# Altium schematic sheet [06] - POWER.SchDoc (part 1 of 2)
size A3; DocumentNumber: 7; SheetNumber: 7; SheetTotal: 12
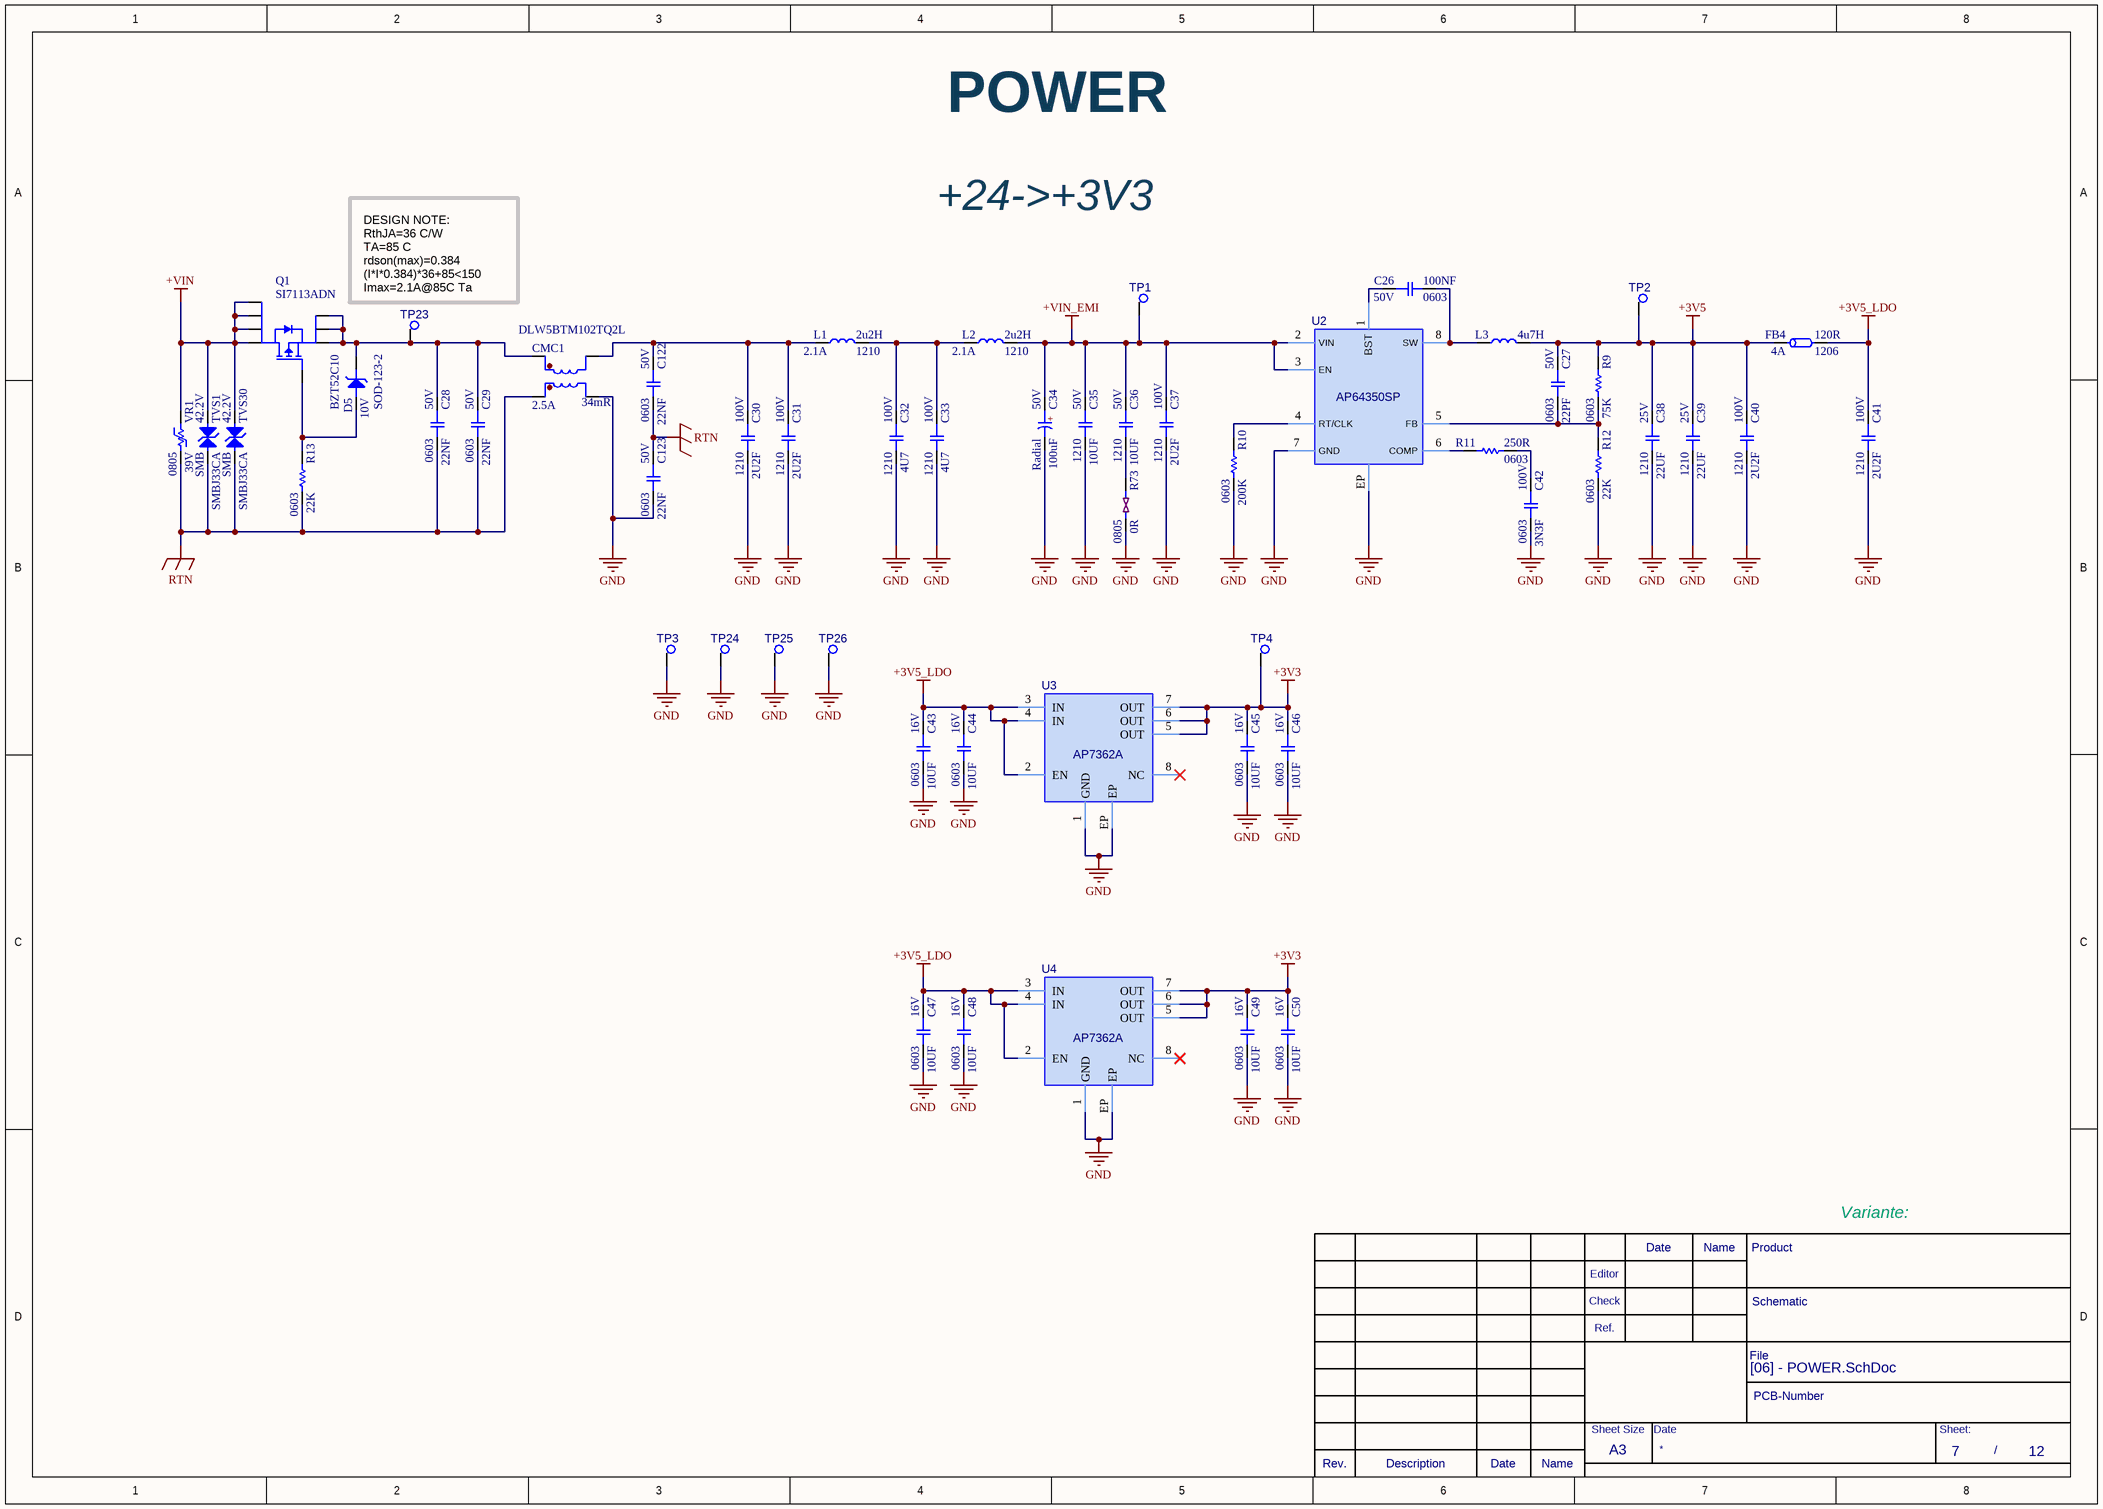
[diagram p0: [06] - POWER.SchDoc]

## Parts
C26  100NF  Voltage Rating: 50V  Case Code (Imperial): 0603  [C-0603]
C27  22PF  Voltage Rating: 50V  Case/Package: 0603  [C-0603]
C28  22NF  Voltage Rating: 50V  Case/Package: 0603  [C-0603]
C29  22NF  Case/Package: 0603  Voltage: 50V  [C-0603]
C30  2U2F  Voltage: 100V  Case/Package: 1210  [C-1210]
C31  2U2F  Voltage: 100V  Case/Package: 1210  [C-1210]
C32  4U7  Case/Package: 1210  Voltage Rating: 100V  [C-1210]
C33  4U7  Case/Package: 1210  Voltage Rating: 100V  [C-1210]
C34  Case/Package: Radial  Voltage Rating (DC): 50V  [C-E-8.3x8.3x10.2]  (hidden comment: 100UF)
C35  10UF  Voltage Rating: 50V  Case/Package: 1210  [C-1210]
C36  10UF  Voltage Rating: 50V  Case/Package: 1210  [C-1210]
C37  2U2F  Voltage: 100V  Case/Package: 1210  [C-1210]
C38  22UF  Voltage Rating: 25V  Case Code (Imperial): 1210  [C-1210]
C39  22UF  Voltage Rating: 25V  Case Code (Imperial): 1210  [C-1210]
C40  2U2F  Voltage: 100V  Case/Package: 1210  [C-1210]
C41  2U2F  Voltage: 100V  Case/Package: 1210  [C-1210]
C42  3N3F  Voltage Rating: 100V  Case/Package: 0603  [C-0603]
C43  10UF  Voltage Rating: 16V  Case/Package: 0603  [C-0603]
C44  10UF  Voltage Rating: 16V  Case/Package: 0603  [C-0603]
C45  10UF  Voltage Rating: 16V  Case/Package: 0603  [C-0603]
C46  10UF  Voltage Rating: 16V  Case/Package: 0603  [C-0603]
C47  10UF  Voltage Rating: 16V  Case/Package: 0603  [C-0603]
C48  10UF  Voltage Rating: 16V  Case/Package: 0603  [C-0603]
C49  10UF  Voltage Rating: 16V  Case/Package: 0603  [C-0603]
C50  10UF  Voltage Rating: 16V  Case/Package: 0603  [C-0603]
C122  22NF  Case/Package: 0603  Voltage: 50V  [C-0603]
C123  22NF  Case/Package: 0603  Voltage: 50V  [C-0603]
CMC1  DLW5BTM102TQ2L  DC Resistance (DCR): 34mR  Max Current Rating: 2.5A  [CMC-DLW5BTM]
D5  BZT52C10  Zener Voltage: 10V  Case/Package: SOD-123-2  [D-SOD123]
FB4  120R  Current Rating: 4A  Case Code (Imperial): 1206  [FB-1206]
L1  2u2H  Case/Package: 1210  Current Rating: 2.1A  [WE-PMCI_1210_H1]
L2  2u2H  Case/Package: 1210  Current Rating: 2.1A  [WE-PMCI_1210_H1]
L3  4u7H  [WE-MAPI_5030]
Q1  SI7113ADN  [PowerPAK 1212-8]
R9  75K  Case/Package: 0603  [R-0603]
R10  200K  Case/Package: 0603  [R-0603]
R11  250R  Case/Package: 0603  [R-0603]
R12  22K  Case Code (Imperial): 0603  [R-0603]
R13  22K  Case/Package: 0603  [R-0603]
R73  0R  Case Code (Imperial): 0805  [JMP-0805]
TP1  MECH-TESTPOINT  [PAD TH]  (value not drawn)  (no BOM)
TP2  MECH-TESTPOINT  [PAD TH]  (value not drawn)  (no BOM)
TP3  MECH-TESTPOINT  [PAD TH]  (value not drawn)  (no BOM)
TP4  MECH-TESTPOINT  [PAD TH]  (value not drawn)  (no BOM)
TP23  MECH-TESTPOINT  [MECH-TESTPOINT]  (value not drawn)  (no BOM)
TP24  MECH-TESTPOINT  [PAD TH]  (value not drawn)  (no BOM)
TP25  MECH-TESTPOINT  [PAD TH]  (value not drawn)  (no BOM)
TP26  MECH-TESTPOINT  [PAD TH]  (value not drawn)  (no BOM)
TVS1  SMBJ33CA  Case/Package: SMB  Breakdown Voltage: 42.2V  [D-SMB-DO214AA-CA]
TVS30  SMBJ33CA  Case/Package: SMB  Breakdown Voltage: 42.2V  [D-SMB-DO214AA-CA]
U2  AP64350SP  [SOIC8-EP]
U3  AP7362A  [SOIC8-EP]
U4  AP7362A  [SOIC8-EP]
VR1  Varistor Voltage: 39V  Case Code (Imperial): 0805  [R-0805]  (hidden comment: B72510E1250K62)

## Nets
+3V3: C45.1 C46.1 C49.1 C50.1 TP4.1 U3.5(OUT) U3.6(OUT) U3.7(OUT) U4.5(OUT) U4.6(OUT) U4.7(OUT)
+3V5: C27.1 C38.1 C39.1 C40.1 FB4.1 L3.2 R9.1 TP2.1
+3V5_LDO: C41.1 C43.1 C44.1 C47.1 C48.1 FB4.2 U3.2(EN) U3.3(IN) U3.4(IN) U4.2(EN) U4.3(IN) U4.4(IN)
+VIN: Q1.5(D) Q1.6(D) Q1.7(D) Q1.8(D) TVS1.A(I/O1) TVS30.A(I/O1) VR1.1
+VIN_EMI: C34.1 C35.1 C36.1 C37.1 L2.2 TP1.1 U2.2(VIN) U2.3(EN)
GND: C30.2 C31.2 C32.2 C33.2 C34.2 C35.2 C37.2 C38.2 C39.2 C40.2 C41.2 C42.2 C43.2 C44.2 C45.2 C46.2 C47.2 C48.2 C49.2 C50.2 C123.2 CMC1.2 R10.2 R12.2 R73.2 TP3.1 TP24.1 TP25.1 TP26.1 U2.7(GND) U2.EP(GND) U3.1(GND) U3.EP U4.1(GND) U4.EP
RTN: C28.2 C29.2 C122.2 C123.1 CMC1.1 R13.2 TVS1.C(I/O2) TVS30.C(I/O2) VR1.2
NetC26_1: C26.1 U2.1(BST)
NetC26_2: C26.2 L3.1 U2.8(SW)
NetC27_2: C27.2 R9.2 R12.1 U2.5(FB)
NetC28_1: C28.1 C29.1 CMC1.4 D5.C Q1.1(S) Q1.2(S) Q1.3(S) TP23.1
NetC30_1: C30.1 C31.1 C122.1 CMC1.3 L1.1
NetC32_1: C32.1 C33.1 L1.2 L2.1
NetC36_2: C36.2 R73.1
NetC42_1: C42.1 R11.2
NetD5_A: D5.A Q1.4(G) R13.1
NetR10_1: R10.1 U2.4(RT/CLK)
NetR11_1: R11.1 U2.6(COMP)

Not connected (* = marked no-connect by the designer): U3 8(NC)*; U4 8(NC)*

## Notes on the sheet
- POWER
- +24->+3V3
- (near TP23) DESIGN NOTE:
  RthJA=36 C/W
  TA=85 C
  rdson(max)=0.384
  (I*I*0.384)*36+85<150
  Imax=2.1A@85C Ta
- Date
- Name
- Product
- Variante:
- Editor
- Check
- Ref.
- Schematic
- File
- PCB-Number
- Rev.
- Description
- Sheet Size
- A3
- Sheet:
- /
- (in symbol C-100UF-SMD) +